# EAGLE design lcd20x4_right (EAGLE 7.2.0)
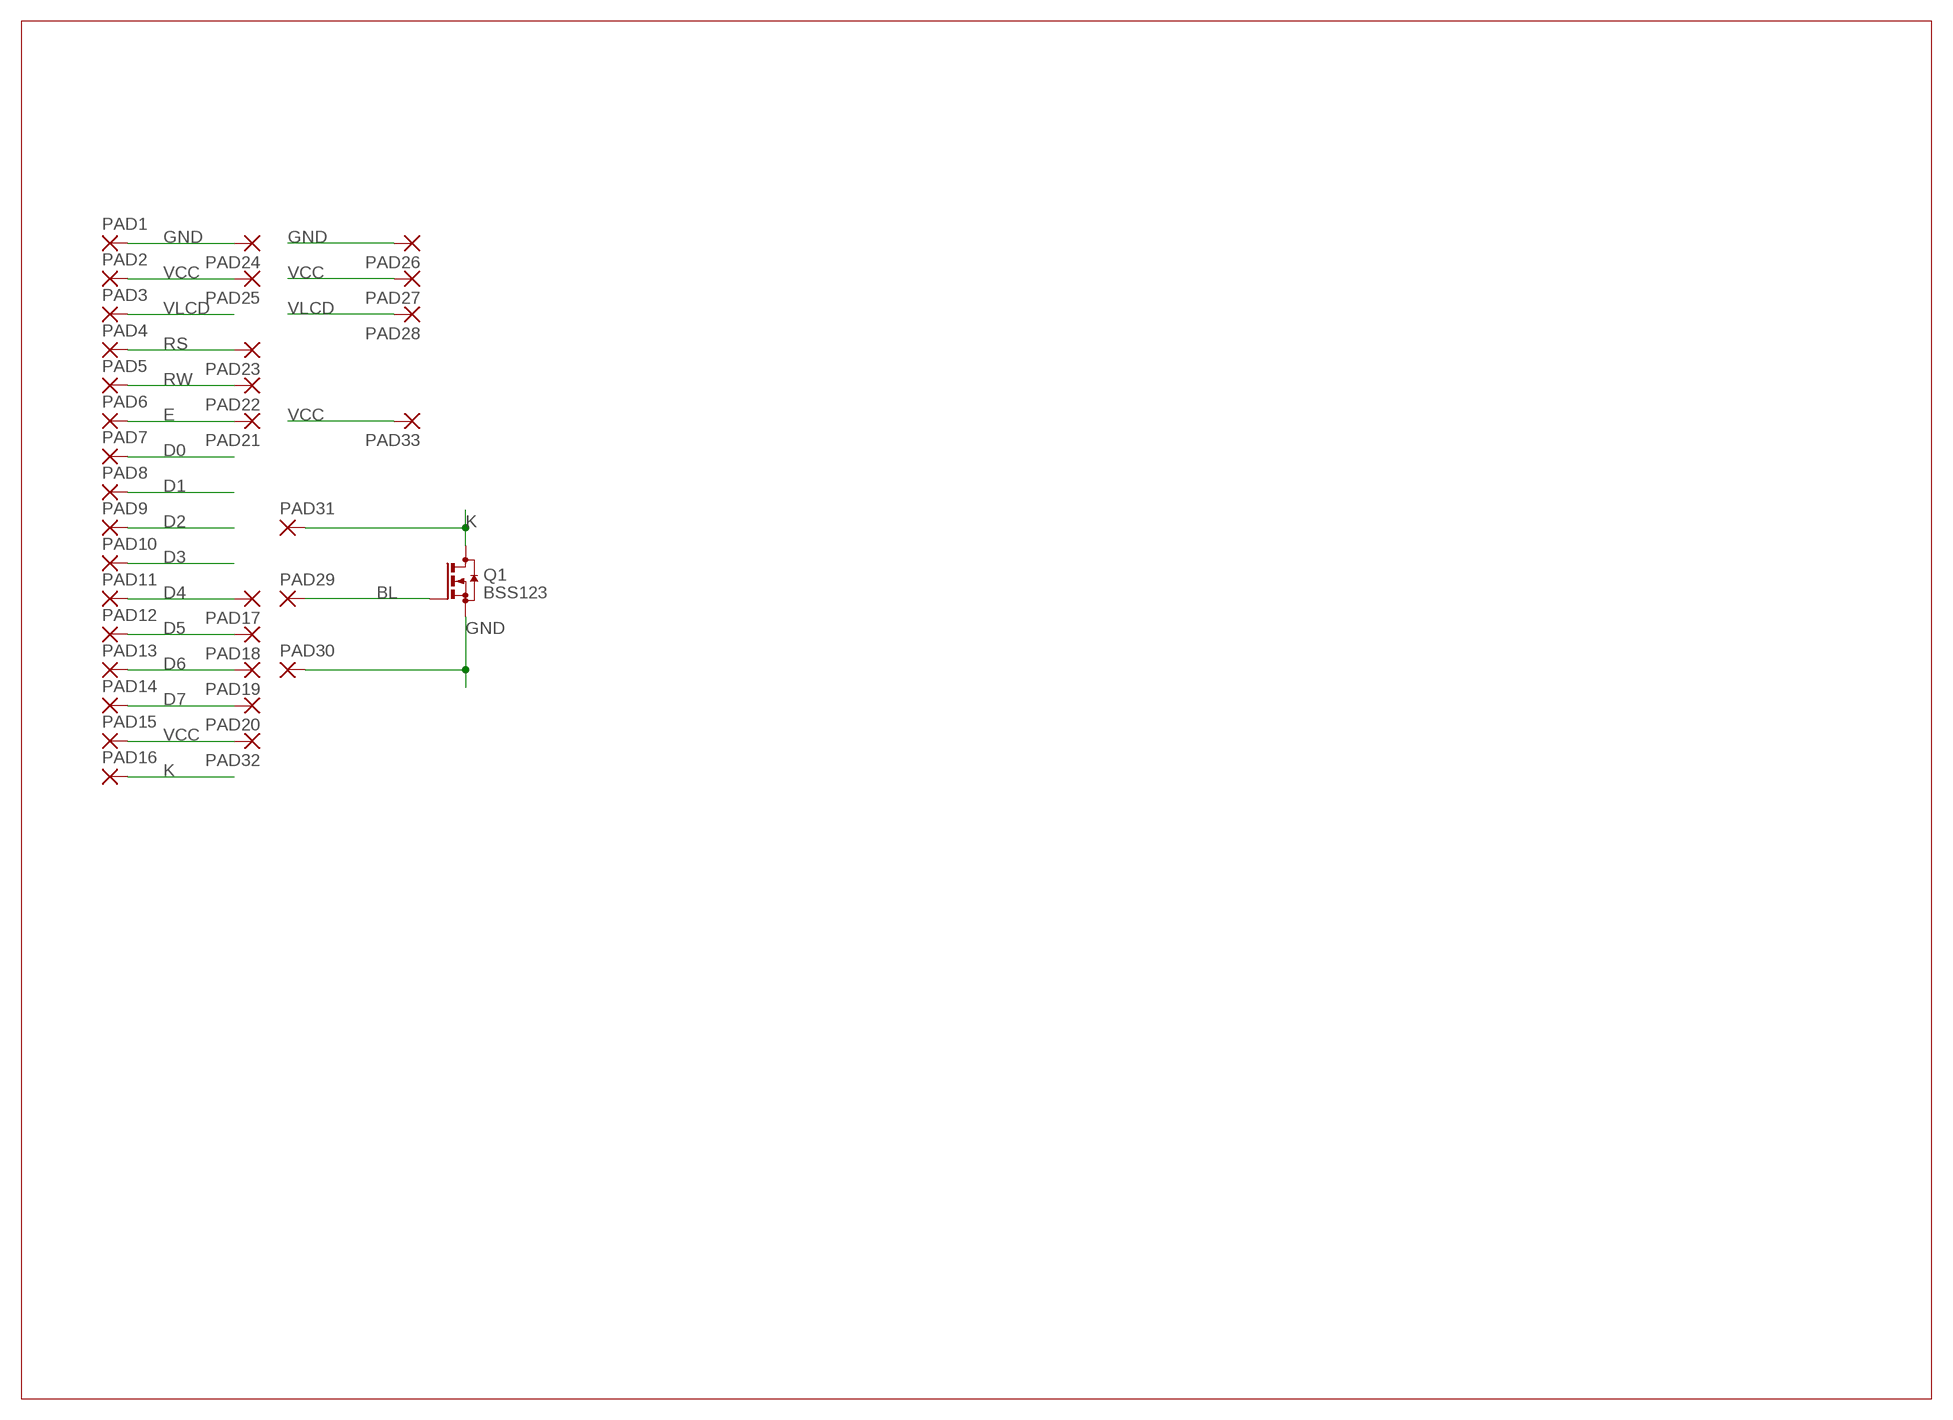
[diagram p0: schematic, sheet 1]

## Parts
PAD1  WIREPAD1,6/0,8  [1,6/0,8]
PAD2  WIREPAD1,6/0,8  [1,6/0,8]
PAD3  WIREPAD1,6/0,8  [1,6/0,8]
PAD4  WIREPAD1,6/0,8  [1,6/0,8]
PAD5  WIREPAD1,6/0,8  [1,6/0,8]
PAD6  WIREPAD1,6/0,8  [1,6/0,8]
PAD7  WIREPAD1,6/0,8  [1,6/0,8]
PAD8  WIREPAD1,6/0,8  [1,6/0,8]
PAD9  WIREPAD1,6/0,8  [1,6/0,8]
PAD10  WIREPAD1,6/0,8  [1,6/0,8]
PAD11  WIREPAD1,6/0,8  [1,6/0,8]
PAD12  WIREPAD1,6/0,8  [1,6/0,8]
PAD13  WIREPAD1,6/0,8  [1,6/0,8]
PAD14  WIREPAD1,6/0,8  [1,6/0,8]
PAD15  WIREPAD1,6/0,8  [1,6/0,8]
PAD16  WIREPAD1,6/0,8  [1,6/0,8]
PAD17  WIREPAD1,6/0,8  [1,6/0,8]
PAD18  WIREPAD1,6/0,8  [1,6/0,8]
PAD19  WIREPAD1,6/0,8  [1,6/0,8]
PAD20  WIREPAD1,6/0,8  [1,6/0,8]
PAD21  WIREPAD1,6/0,8  [1,6/0,8]
PAD22  WIREPAD1,6/0,8  [1,6/0,8]
PAD23  WIREPAD1,6/0,8  [1,6/0,8]
PAD24  WIREPAD1,6/0,8  [1,6/0,8]
PAD25  WIREPAD1,6/0,8  [1,6/0,8]
PAD26  WIREPAD1,6/0,8  [1,6/0,8]
PAD27  WIREPAD1,6/0,8  [1,6/0,8]
PAD28  WIREPAD1,6/0,8  [1,6/0,8]
PAD29  WIREPAD1,6/0,8  [1,6/0,8]
PAD30  WIREPAD1,6/0,8  [1,6/0,8]
PAD31  WIREPAD1,6/0,8  [1,6/0,8]
PAD32  WIREPAD1,6/0,8  [1,6/0,8]
PAD33  WIREPAD1,6/0,8  [1,6/0,8]
Q1  BSS123  [SOT23]

## Nets
BL: PAD29.1(P) Q1.1(G)
D0: PAD7.1(P)
D1: PAD8.1(P)
D2: PAD9.1(P)
D3: PAD10.1(P)
D4: PAD11.1(P) PAD17.1(P)
D5: PAD12.1(P) PAD18.1(P)
D6: PAD13.1(P) PAD19.1(P)
D7: PAD14.1(P) PAD20.1(P)
E: PAD6.1(P) PAD21.1(P)
GND: PAD1.1(P) PAD24.1(P) PAD26.1(P) PAD30.1(P) Q1.2(S)
K: PAD16.1(P) PAD31.1(P) Q1.3(D)
RS: PAD4.1(P) PAD23.1(P)
RW: PAD5.1(P) PAD22.1(P)
VCC: PAD2.1(P) PAD15.1(P) PAD25.1(P) PAD27.1(P) PAD32.1(P) PAD33.1(P)
VLCD: PAD3.1(P) PAD28.1(P)

## Library data of the parts
PAD1-PAD33 = wirepad:WIREPAD: Wire PAD connect wire on PCB
Q1 = transistor-small-signal:BSS123: N-CHANNEL MOS FET

## Board
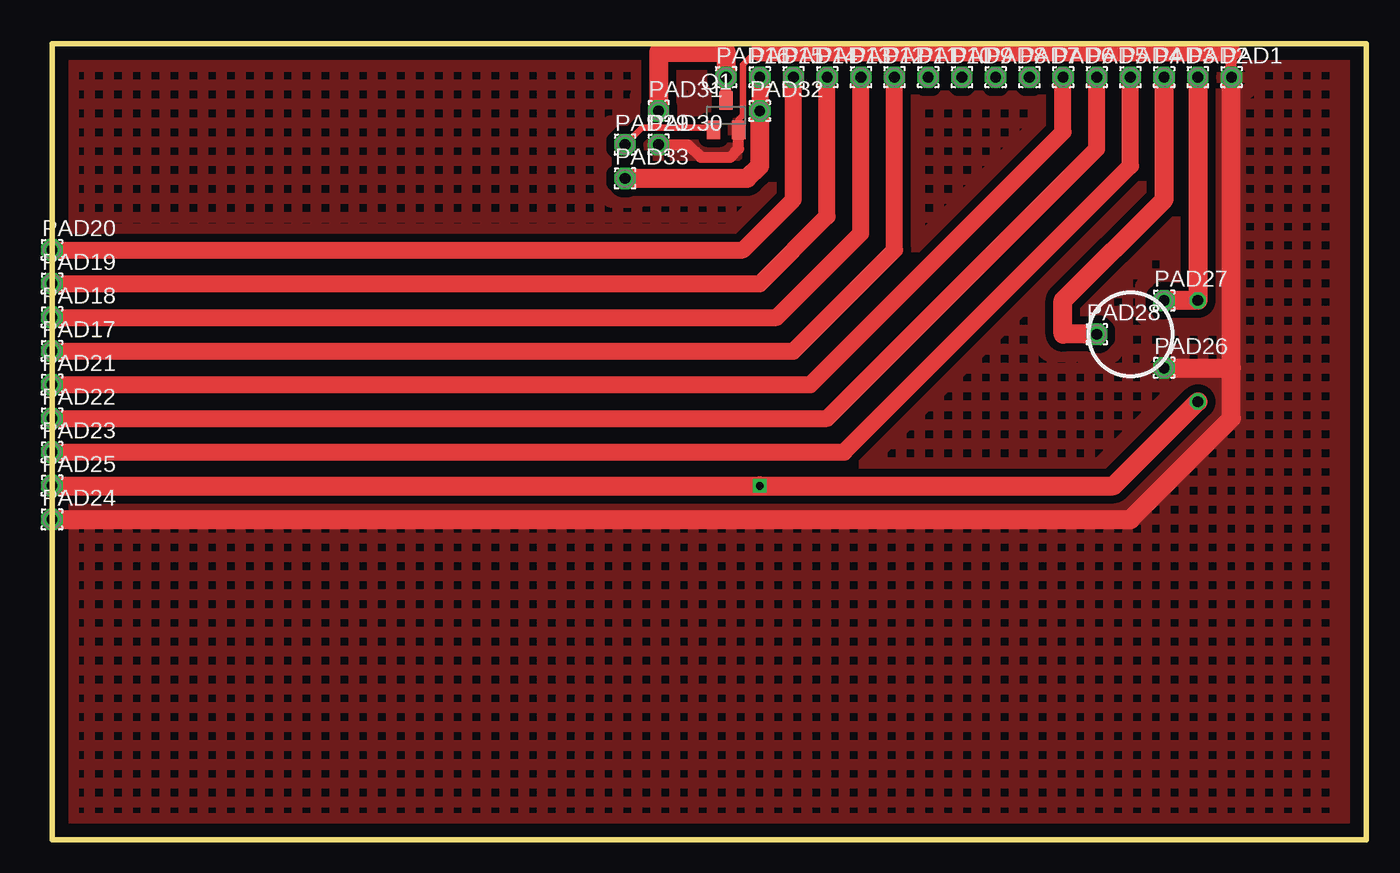
[diagram p1: board, top side]
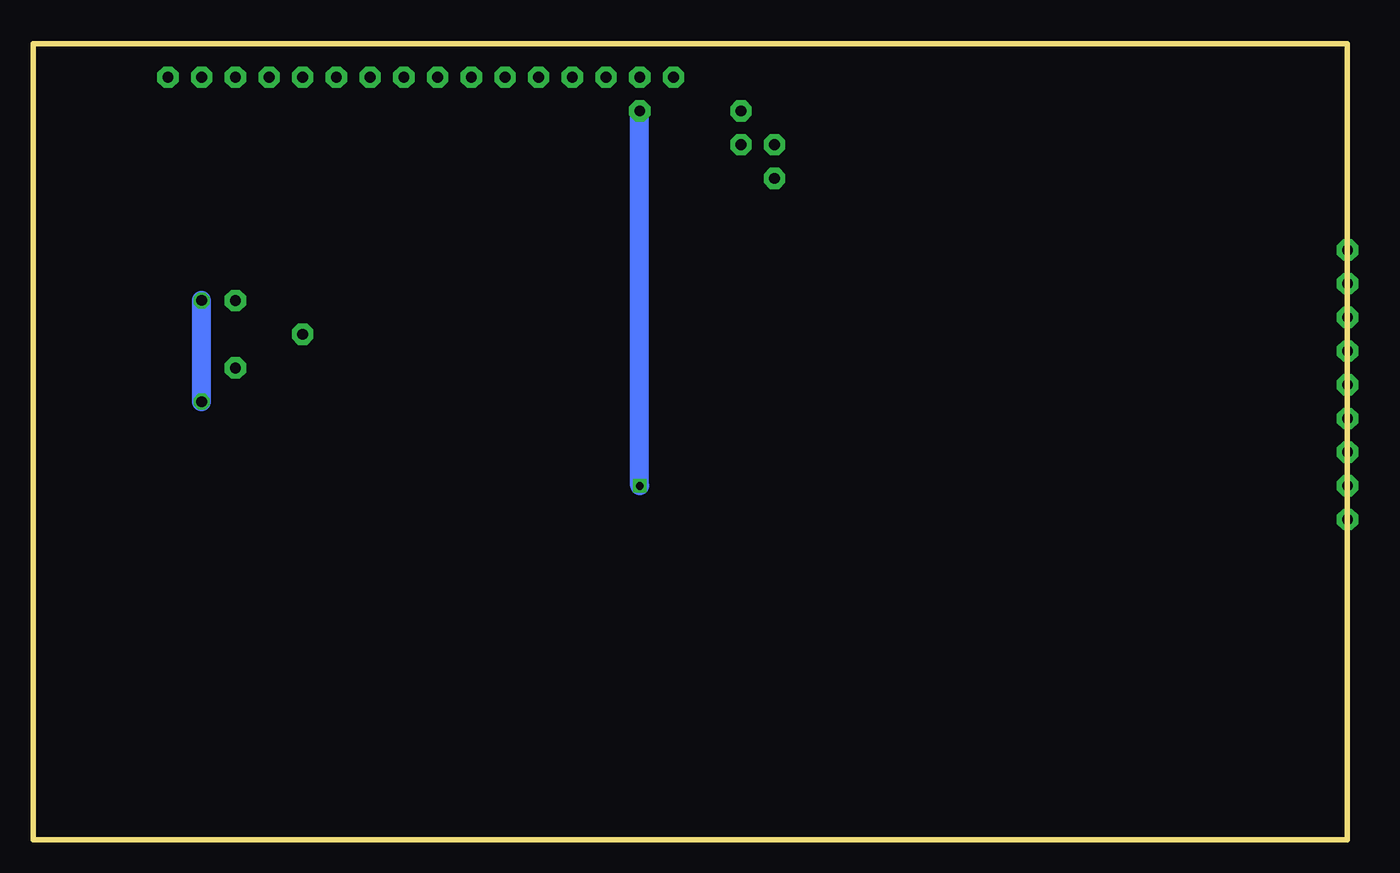
[diagram p2: board, bottom side, seen from below]

Size 99.06 x 60.01 mm. Coordinates in mm from the lower left corner, seen from the top.
Outline: 0,0 99.06,0 99.06,60.01 0,60.01 0,0
Copper layers (1*16): Top 0.035mm / dielectric 1.5mm / Bottom 0.035mm
Design rules "default": minimum track width 10mil, minimum drill 24mil, track to track 8mil, track to pad 8mil, pad to pad 8mil, via to via 8mil, smd to smd 8mil, copper to edge 40mil, drill to drill 8mil, minimum pad ring 10mil, minimum via ring 8mil, stop-mask expansion 4mil, vias tented up to drill 0mil, thermal gap 10mil

### Footprints (pad centres in the part's own frame; a part is rotated, then mirrored left to right if it is on the bottom)
1,6/0,8 = drill 0.813 pad 1.6 octagon: 1 0,0
SOT23 = smd 1 x 1.4: 1 -0.95,-1.1; 2 0.95,-1.1; 3 0,1.1

### Placement (x,y rotation side)
PAD1  88.9,57.47 0 top
PAD2  86.36,57.47 0 top
PAD3  83.82,57.47 0 top
PAD4  81.28,57.47 0 top
PAD5  78.74,57.47 0 top
PAD6  76.2,57.47 0 top
PAD7  73.66,57.47 0 top
PAD8  71.12,57.47 0 top
PAD9  68.58,57.47 0 top
PAD10  66.04,57.47 0 top
PAD11  63.5,57.47 0 top
PAD12  60.96,57.47 0 top
PAD13  58.42,57.47 0 top
PAD14  55.88,57.47 0 top
PAD15  53.34,57.47 0 top
PAD16  50.8,57.47 0 top
PAD17  0,36.83 0 top
PAD18  0,39.37 0 top
PAD19  0,41.91 0 top
PAD20  0,44.45 0 top
PAD21  0,34.29 0 top
PAD22  0,31.75 0 top
PAD23  0,29.21 0 top
PAD24  0,24.13 0 top
PAD25  0,26.67 0 top
PAD26  83.82,35.56 0 top
PAD27  83.82,40.64 0 top
PAD28  78.74,38.1 0 top
PAD29  43.18,52.39 0 top
PAD30  45.72,52.39 0 top
PAD31  45.72,54.93 0 top
PAD32  53.34,54.93 0 top
PAD33  43.18,49.85 0 top
Q1  50.8,54.61 0 top

### Tracks (layer width: path | path; a pad name or v marks a point on that pad's centre or on a via)
BL
  Top 0.508: PAD29.1 44.45,53.66 49.7,53.66 Q1.1
D4
  Top 1.27: PAD17.1 55.88,36.83 63.5,44.45 PAD11.1
D5
  Top 1.27: PAD18.1 54.61,39.37 60.96,45.72 PAD12.1
D6
  Top 1.27: PAD19.1 53.34,41.91 58.42,46.99 PAD13.1
D7
  Top 1.27: PAD20.1 52.07,44.45 55.88,48.26 PAD14.1
E
  Top 1.27: PAD21.1 57.15,34.29 76.2,53.34 PAD6.1
GND
  Top 0.508: Q1.2 51.75,54.29 52.07,54.61 52.07,58.42 53.02,59.37 53.34,59.37
  Top 0.813: PAD1.1 88.9,59.37 | PAD30.1 47.94,52.39 48.9,51.44 51.12,51.44 51.75,52.07 Q1.2
  Top 1.422: 88.9,59.37 53.34,59.37 | 88.9,35.56 PAD1.1 | PAD26.1 88.9,35.56 | PAD24.1 81.28,24.13 88.9,31.75 88.9,35.56
  pour Top (isolate 0.61, hatched): 0,0 99.06,0 99.06,59.69 0,59.69
K
  Top 0.813: Q1.3 PAD16.1
  Top 1.422: PAD16.1 50.8,59.37 45.72,59.37 PAD31.1
RS
  Top 1.27: PAD23.1 59.69,29.21 81.28,50.8 PAD4.1
RW
  Top 1.27: PAD22.1 58.42,31.75 78.74,52.07 PAD5.1
VCC  (via drill 0.6, 0.8)
  Top 1.27: PAD15.1 PAD32.1
  Top 1.422: PAD27.1 v86.36,40.64 PAD2.1 | v86.36,33.02 80.01,26.67 v53.34,26.67 PAD25.1 | PAD33.1 52.39,49.85 53.34,50.8 PAD32.1
  Bottom 1.422: v86.36,33.02 v86.36,40.64 | v53.34,26.67 PAD32.1
  other vias: 53.34,54.93
VLCD
  Top 1.422: PAD28.1 76.2,38.1 76.2,40.64 83.82,48.26 PAD3.1